# EAGLE design LedPanel_v010 (EAGLE 9.6.2)
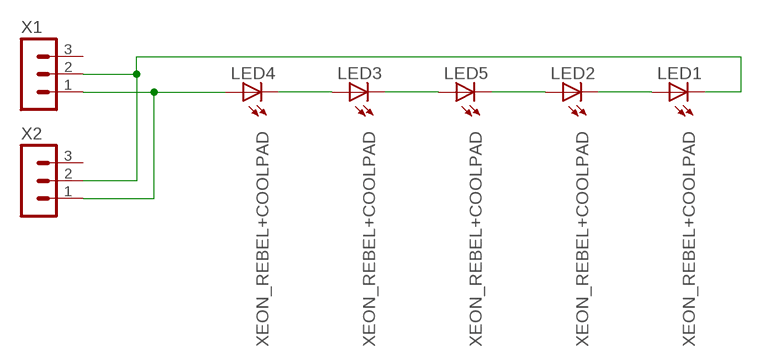
[diagram p0: schematic, sheet 1]

## Parts
LED1  LUXEON_REBEL+COOLPAD  [LUXEON_REBEL+COOLPAD]
LED2  LUXEON_REBEL+COOLPAD  [LUXEON_REBEL+COOLPAD]
LED3  LUXEON_REBEL+COOLPAD  [LUXEON_REBEL+COOLPAD]
LED4  LUXEON_REBEL+COOLPAD  [LUXEON_REBEL+COOLPAD]
LED5  LUXEON_REBEL+COOLPAD  [LUXEON_REBEL+COOLPAD]
X1  MA03-1  [MA03-1]
X2  MA03-1  [MA03-1]

## Nets
LED_A: LED4.A LED4.A@1(A) X1.1 X2.1
LED_K: LED1.C LED1.C@1(C) X1.2 X2.2
N$1: LED1.A LED1.A@1(A) LED2.C LED2.C@1(C)
N$2: LED2.A LED2.A@1(A) LED5.C LED5.C@1(C)
N$3: LED3.C LED3.C@1(C) LED5.A LED5.A@1(A)
N$4: LED3.A LED3.A@1(A) LED4.C LED4.C@1(C)
Unconnected: X1.3 X2.3

## Power pins joined to a net without a drawn wire
TH: LED1.TH LED1.TH@1(TH) LED1.TH@2(TH) LED1.TH@3(TH) LED1.TH@4(TH) LED1.TH@5(TH) LED1.TH@6(TH) LED1.TH@7(TH) LED1.TH@8(TH) LED1.TH@9(TH) LED1.TH@10(TH) LED1.TH@11(TH) LED1.TH@12(TH) LED1.TH@13(TH) LED1.TH@14(TH) LED1.TH@15(TH) LED1.TH@16(TH) LED1.TH@17(TH) LED1.TH@18(TH) LED1.TH@19(TH) LED1.TH@20(TH) LED1.TH@21(TH) LED1.TH@22(TH) LED1.TH@23(TH) LED1.TH@24(TH) LED1.TH@25(TH) LED1.TH@26(TH) LED1.TH@27(TH) LED1.TH@28(TH) LED1.TH@29(TH) LED1.TH@30(TH) LED1.TH@31(TH) LED1.TH@32(TH) LED1.TH@33(TH) LED1.TH@34(TH) LED1.TH@35(TH) LED2.TH LED2.TH@1(TH) LED2.TH@2(TH) LED2.TH@3(TH) LED2.TH@4(TH) LED2.TH@5(TH) LED2.TH@6(TH) LED2.TH@7(TH) LED2.TH@8(TH) LED2.TH@9(TH) LED2.TH@10(TH) LED2.TH@11(TH) LED2.TH@12(TH) LED2.TH@13(TH) LED2.TH@14(TH) LED2.TH@15(TH) LED2.TH@16(TH) LED2.TH@17(TH) LED2.TH@18(TH) LED2.TH@19(TH) LED2.TH@20(TH) LED2.TH@21(TH) LED2.TH@22(TH) LED2.TH@23(TH) LED2.TH@24(TH) LED2.TH@25(TH) LED2.TH@26(TH) LED2.TH@27(TH) LED2.TH@28(TH) LED2.TH@29(TH) LED2.TH@30(TH) LED2.TH@31(TH) LED2.TH@32(TH) LED2.TH@33(TH) LED2.TH@34(TH) LED2.TH@35(TH) LED3.TH LED3.TH@1(TH) LED3.TH@2(TH) LED3.TH@3(TH) LED3.TH@4(TH) LED3.TH@5(TH) LED3.TH@6(TH) LED3.TH@7(TH) LED3.TH@8(TH) LED3.TH@9(TH) LED3.TH@10(TH) LED3.TH@11(TH) LED3.TH@12(TH) LED3.TH@13(TH) LED3.TH@14(TH) LED3.TH@15(TH) LED3.TH@16(TH) LED3.TH@17(TH) LED3.TH@18(TH) LED3.TH@19(TH) LED3.TH@20(TH) LED3.TH@21(TH) LED3.TH@22(TH) LED3.TH@23(TH) LED3.TH@24(TH) LED3.TH@25(TH) LED3.TH@26(TH) LED3.TH@27(TH) LED3.TH@28(TH) LED3.TH@29(TH) LED3.TH@30(TH) LED3.TH@31(TH) LED3.TH@32(TH) LED3.TH@33(TH) LED3.TH@34(TH) LED3.TH@35(TH) LED4.TH LED4.TH@1(TH) LED4.TH@2(TH) LED4.TH@3(TH) LED4.TH@4(TH) LED4.TH@5(TH) LED4.TH@6(TH) LED4.TH@7(TH) LED4.TH@8(TH) LED4.TH@9(TH) LED4.TH@10(TH) LED4.TH@11(TH) LED4.TH@12(TH) LED4.TH@13(TH) LED4.TH@14(TH) LED4.TH@15(TH) LED4.TH@16(TH) LED4.TH@17(TH) LED4.TH@18(TH) LED4.TH@19(TH) LED4.TH@20(TH) LED4.TH@21(TH) LED4.TH@22(TH) LED4.TH@23(TH) LED4.TH@24(TH) LED4.TH@25(TH) LED4.TH@26(TH) LED4.TH@27(TH) LED4.TH@28(TH) LED4.TH@29(TH) LED4.TH@30(TH) LED4.TH@31(TH) LED4.TH@32(TH) LED4.TH@33(TH) LED4.TH@34(TH) LED4.TH@35(TH) LED5.TH LED5.TH@1(TH) LED5.TH@2(TH) LED5.TH@3(TH) LED5.TH@4(TH) LED5.TH@5(TH) LED5.TH@6(TH) LED5.TH@7(TH) LED5.TH@8(TH) LED5.TH@9(TH) LED5.TH@10(TH) LED5.TH@11(TH) LED5.TH@12(TH) LED5.TH@13(TH) LED5.TH@14(TH) LED5.TH@15(TH) LED5.TH@16(TH) LED5.TH@17(TH) LED5.TH@18(TH) LED5.TH@19(TH) LED5.TH@20(TH) LED5.TH@21(TH) LED5.TH@22(TH) LED5.TH@23(TH) LED5.TH@24(TH) LED5.TH@25(TH) LED5.TH@26(TH) LED5.TH@27(TH) LED5.TH@28(TH) LED5.TH@29(TH) LED5.TH@30(TH) LED5.TH@31(TH) LED5.TH@32(TH) LED5.TH@33(TH) LED5.TH@34(TH) LED5.TH@35(TH)

## Library data of the parts
LED1-LED5 = led-rebel:LUXEON_REBEL+COOLPAD: LUXEON REBEL LED with cooling pads Display Layer Refence in Board for more information Stop and Cream Mask defined by Luxeon Rebel Footprint _customer.dxf; OC_FARNELL: unknown; OC_NEWARK: unknown
X1 X2 = con-lstb:MA03-1: PIN HEADER; OC_FARNELL: unknown; OC_NEWARK: unknown

## Net classes
0 default: clearance 0.381 mm

## Board
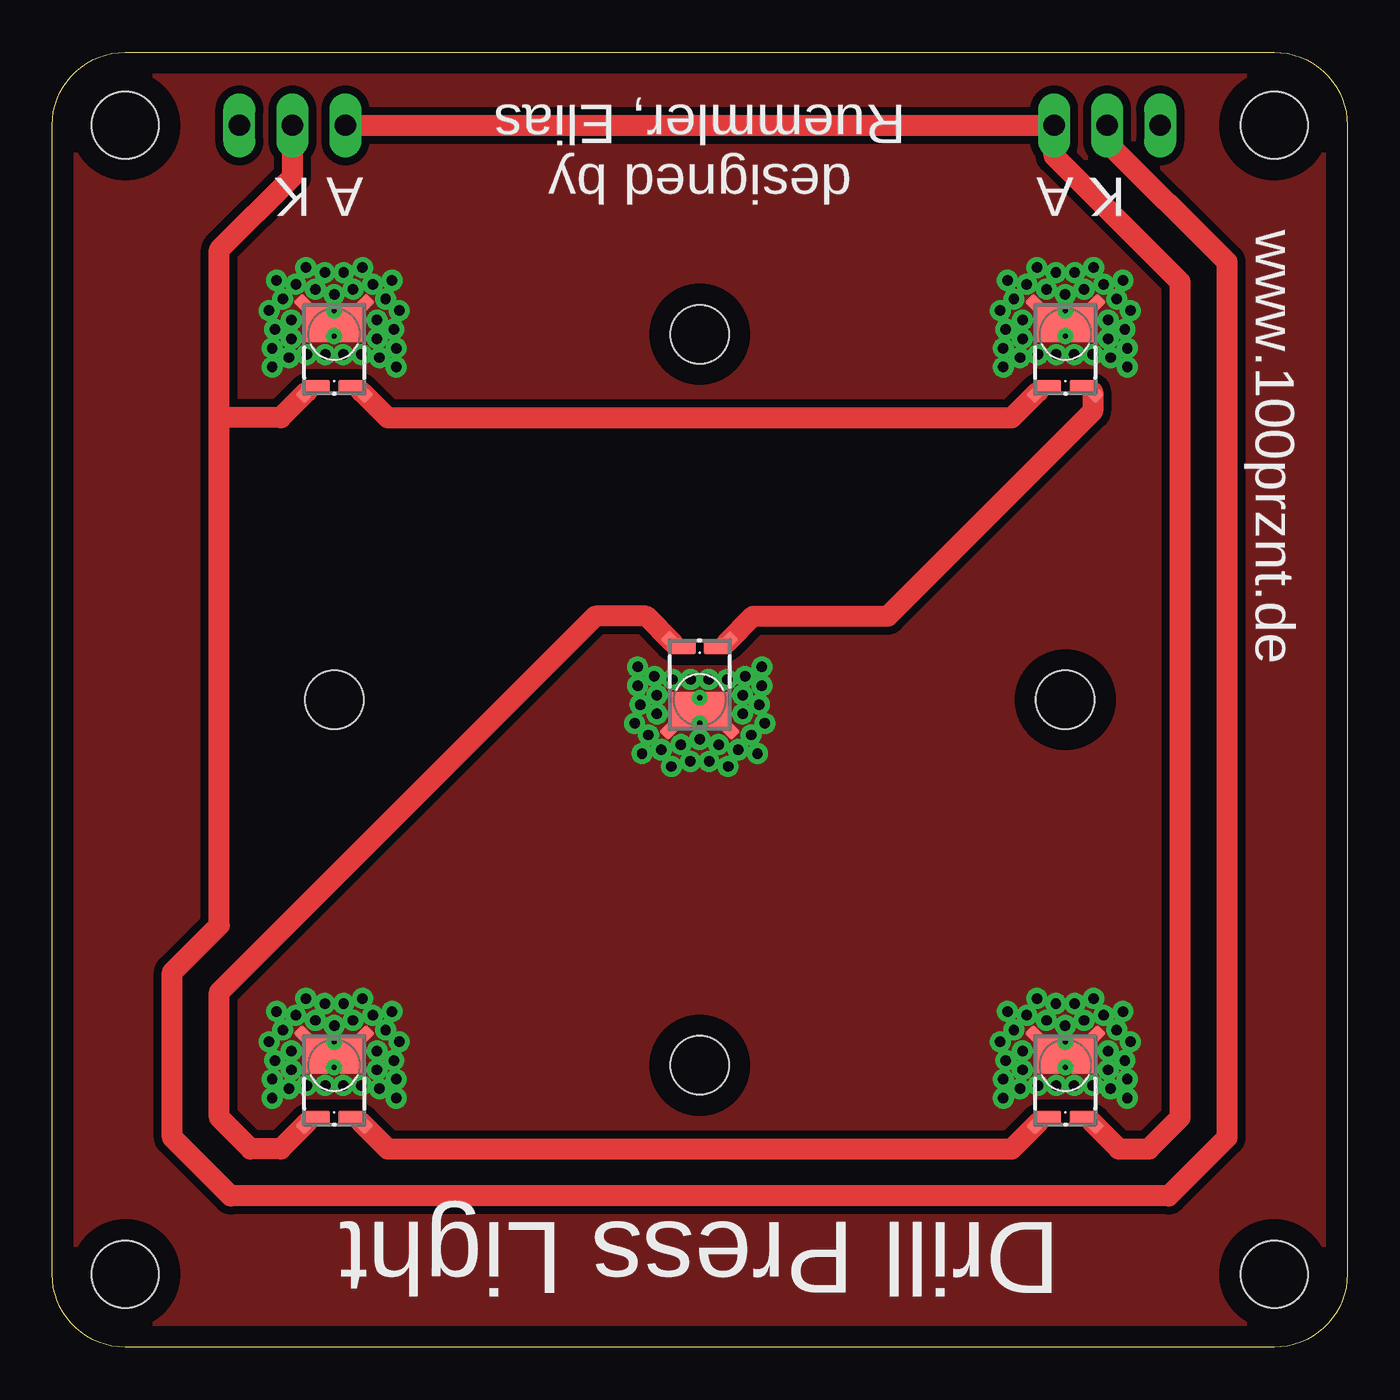
[diagram p1: board, top side]
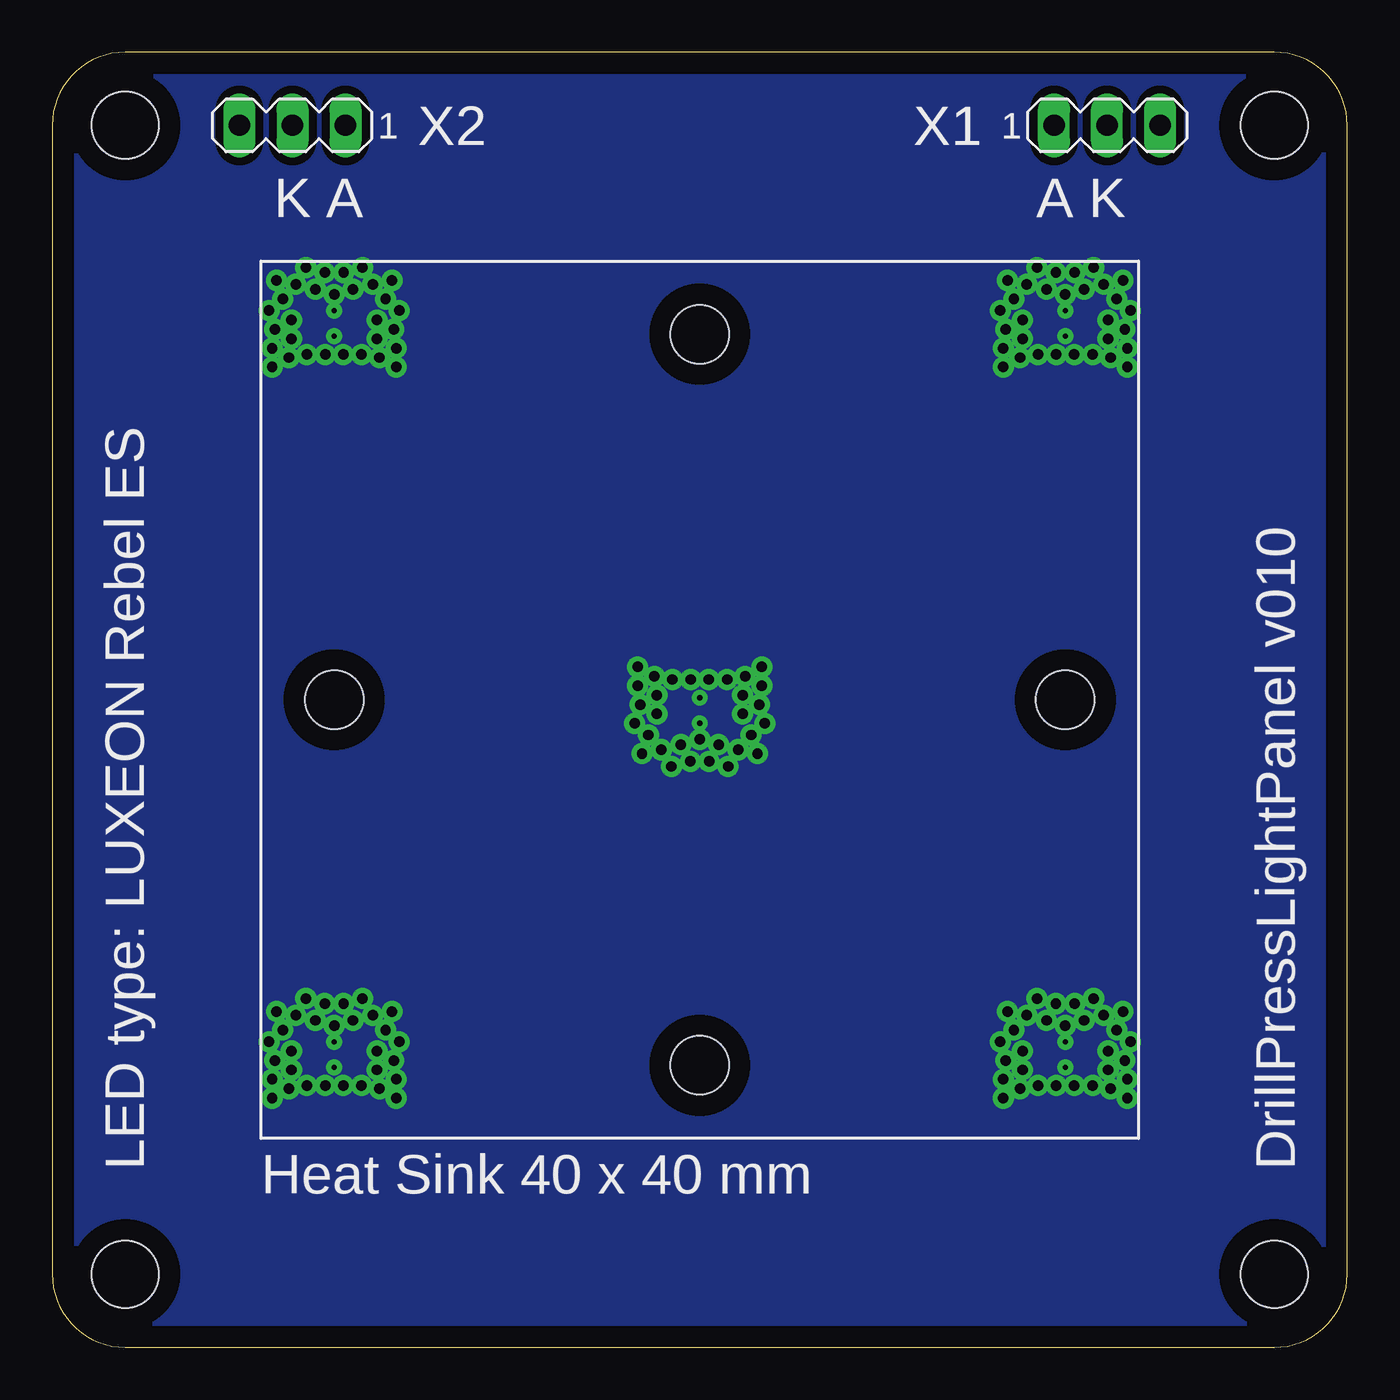
[diagram p2: board, bottom side, seen from below]

Size 62 x 62 mm. Coordinates in mm from the lower left corner, seen from the top.
Outline: 58.5,0 3.5,0 arc-90 0,3.5 0,58.5 arc-90 3.5,62 58.5,62 arc-90 62,58.5 62,3.5 arc-90 58.5,0
Copper layers (1*16): Top 0.035mm / dielectric 1.5mm / Bottom 0.035mm
Design rules "default": minimum track width 6mil, minimum drill 0.35mm, track to track 6mil, track to pad 6mil, pad to pad 6mil, via to via 6mil, smd to smd 6mil, copper to edge 40mil, drill to drill 6mil, minimum pad ring 10mil, minimum via ring 8mil, stop-mask expansion 4mil, vias tented up to drill 0mil, thermal gap 10mil
Holes 3.2 mm at 3.5,3.5 58.5,3.5 58.5,58.5 3.5,58.5
Holes 2.8 mm at 31,48.5 31,13.5 48.5,31 13.5,31

### Footprints (pad centres in the part's own frame; a part is rotated, then mirrored left to right if it is on the bottom)
LUXEON_REBEL+COOLPAD = smd 1.2 x 0.67: A 0.8,-2.51; C -0.8,-2.51 | smd 1 x 0.6 rotated 315: A@1 1.31,-2.75 | smd 1 x 0.6 rotated 225: C@1 -1.31,-2.75 | smd 2.8 x 1.77: TH 0,0.51 | smd 1 x 0.6 rotated 135: TH@1 -1.39,1.39 | smd 1 x 0.6 rotated 45: TH@2 1.39,1.39 | drill 0.5 pad 0.6: TH@3 2.971,-1.57; TH@4 2.971,-0.67; TH@5 2.85,0.23; TH@6 2.05,0.68; TH@7 2.05,-0.22; TH@8 2.171,-1.12; TH@9 2.764,2.575; TH@10 3.116,1.13; TH@11 2.461,1.687; TH@12 1.844,2.394; TH@13 0.9,2.15; TH@14 0,1.9; TH@15 0.45,2.95; TH@16 1.356,3.196; TH@17 1.31,-0.97; TH@18 0.43,-0.97; TH@21 -2.971,-1.57; TH@22 -2.971,-0.67; TH@23 -2.85,0.23; TH@24 -2.05,0.68; TH@25 -2.05,-0.22; TH@26 -2.171,-1.12; TH@27 -2.764,2.575; TH@28 -3.116,1.13; TH@29 -2.461,1.687; TH@30 -1.844,2.394; TH@31 -0.9,2.15; TH@32 -0.45,2.95; TH@33 -1.356,3.196; TH@34 -1.31,-0.97; TH@35 -0.43,-0.97 | drill 0.25 pad 0.4: TH@19 0,-0.095; TH@20 0,1.125
MA03-1 = drill 1.016 long: 1 -2.54,0; 2 0,0; 3 2.54,0

### Placement (x,y rotation side)
LED1  13.5,48.5 0 top
LED2  48.5,48.5 0 top
LED3  13.5,13.5 0 top
LED4  48.5,13.5 0 top
LED5  31,31 180 top
X1  11.5,58.5 0 bottom
X2  50.5,58.5 180 bottom

### Tracks (layer width: path | path; a pad name or v marks a point on that pad's centre or on a via)
LED_A
  Top 1: LED4.A@1 51.06,9.5 52.5,9.5 54,11 54,51 47.96,57.04 X2.1 X1.1
LED_K
  Top 1: LED1.C@1 10.94,44.5 8,44.5 | 8,44.5 8,20.2 5.75,17.95 5.75,10.05 8.55,7.25 53.45,7.25 56.25,10.05 56.25,51.95 50.5,57.7 X2.2 | 8,44.5 8,52.54 11.5,56.04 X1.2
N$1
  Top 1: LED1.A@1 16.06,44.5 45.94,44.5 LED2.C@1
N$2
  Top 1: LED2.A@1 49.81,44.81 40,35 33.56,35 LED5.C@1
N$3
  Top 1: LED3.C@1 10.94,9.5 9.5,9.5 8,11 8,17 26,35 28.44,35 LED5.A@1
N$4
  Top 1: LED4.C@1 45.94,9.5 16.06,9.5 LED3.A@1
TH
  pour Top (no thermals): 0.5,0.5 0.5,61.5 61.5,61.5 61.5,0.5
  pour Bottom (no thermals): 1,61 61,61 61,1 1,1

### Text on the board
tPlace: designed by / Ruemmler, Elias | K | A | A | K | www.100prznt.de | Drill Press Light
bPlace: K | A | A | K | DrillPressLightPanel v010 | Heat Sink 40 x 40 mm | LED type: LUXEON Rebel ES
tStop: #100prznt